# Altium schematic sheet SDRAM.SchDoc
size A4
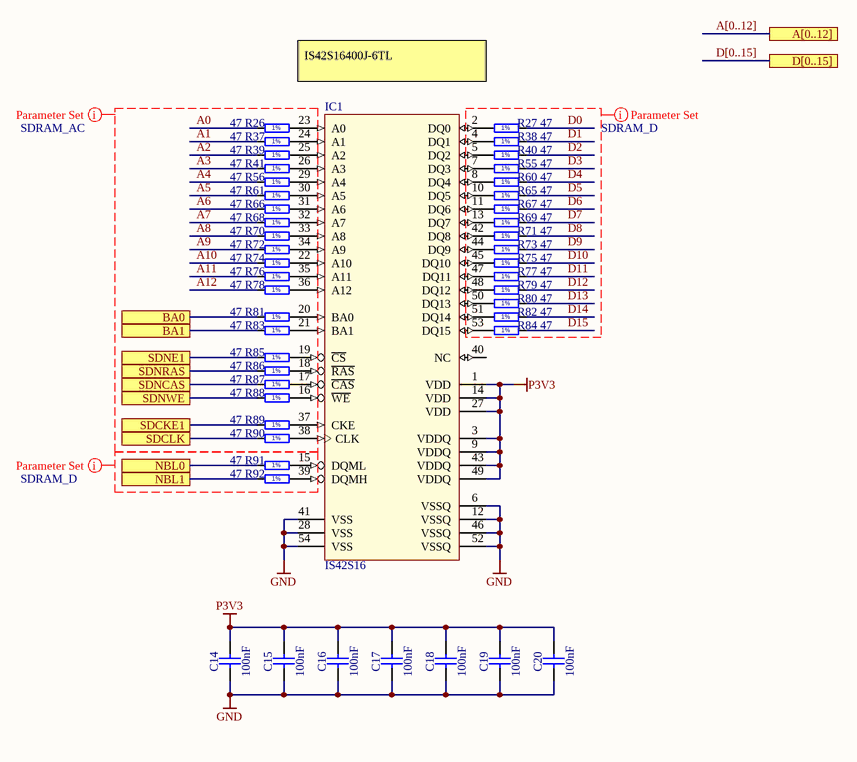
[diagram p0: SDRAM.SchDoc]

## Parts
C14  100nF  [CAPC1005X55N]
C15  100nF  [CAPC1005X55N]
C16  100nF  [CAPC1005X55N]
C17  100nF  [CAPC1005X55N]
C18  100nF  [CAPC1005X55N]
C19  100nF  [CAPC1005X55N]
C20  100nF  [CAPC1005X55N]
IC1  IS42S16  [TSOP-54]
R26  47  [RESC1005X40N]
R27  47  [RESC1005X40N]
R37  47  [RESC1005X40N]
R38  47  [RESC1005X40N]
R39  47  [RESC1005X40N]
R40  47  [RESC1005X40N]
R41  47  [RESC1005X40N]
R55  47  [RESC1005X40N]
R56  47  [RESC1005X40N]
R60  47  [RESC1005X40N]
R61  47  [RESC1005X40N]
R65  47  [RESC1005X40N]
R66  47  [RESC1005X40N]
R67  47  [RESC1005X40N]
R68  47  [RESC1005X40N]
R69  47  [RESC1005X40N]
R70  47  [RESC1005X40N]
R71  47  [RESC1005X40N]
R72  47  [RESC1005X40N]
R73  47  [RESC1005X40N]
R74  47  [RESC1005X40N]
R75  47  [RESC1005X40N]
R76  47  [RESC1005X40N]
R77  47  [RESC1005X40N]
R78  47  [RESC1005X40N]
R79  47  [RESC1005X40N]
R80  47  [RESC1005X40N]
R81  47  [RESC1005X40N]
R82  47  [RESC1005X40N]
R83  47  [RESC1005X40N]
R84  47  [RESC1005X40N]
R85  47  [RESC1005X40N]
R86  47  [RESC1005X40N]
R87  47  [RESC1005X40N]
R88  47  [RESC1005X40N]
R89  47  [RESC1005X40N]
R90  47  [RESC1005X40N]
R91  47  [RESC1005X40N]
R92  47  [RESC1005X40N]

## Ports
A[0..12], BA0, BA1, D[0..15], NBL0, NBL1, SDCKE1, SDCLK, SDNCAS, SDNE1, SDNRAS, SDNWE

## Nets
GND: C14.1 C15.1 C16.1 C17.1 C18.1 C19.1 C20.1 IC1.6(VSSQ) IC1.12(VSSQ) IC1.28(VSS) IC1.41(VSS) IC1.46(VSSQ) IC1.52(VSSQ) IC1.54(VSS)
P3V3: C14.2 C15.2 C16.2 C17.2 C18.2 C19.2 C20.2 IC1.1(VDD) IC1.3(VDDQ) IC1.9(VDDQ) IC1.14(VDD) IC1.27(VDD) IC1.43(VDDQ) IC1.49(VDDQ)
A0: R26.2
A1: R37.2
A2: R39.2
A3: R41.2
A4: R56.2
A5: R61.2
A6: R66.2
A7: R68.2
A8: R70.2
A9: R72.2
A10: R74.2
A11: R76.2
A12: R78.2
BA0: R81.2 ; port BA0
BA1: R83.2 ; port BA1
D0: R27.2
D1: R38.2
D2: R40.2
D3: R55.2
D4: R60.2
D5: R65.2
D6: R67.2
D7: R69.2
D8: R71.2
D9: R73.2
D10: R75.2
D11: R77.2
D12: R79.2
D13: R80.2
D14: R82.2
D15: R84.2
NBL0: R91.2 ; port NBL0
NBL1: R92.2 ; port NBL1
SDCKE1: R89.2 ; port SDCKE1
SDCLK: R90.2 ; port SDCLK
SDNCAS: R87.2 ; port SDNCAS
SDNE1: R85.2 ; port SDNE1
SDNRAS: R86.2 ; port SDNRAS
SDNWE: R88.2 ; port SDNWE
NetIC1_2: IC1.2(DQ0) R27.1
NetIC1_4: IC1.4(DQ1) R38.1
NetIC1_5: IC1.5(DQ2) R40.1
NetIC1_7: IC1.7(DQ3) R55.1
NetIC1_8: IC1.8(DQ4) R60.1
NetIC1_10: IC1.10(DQ5) R65.1
NetIC1_11: IC1.11(DQ6) R67.1
NetIC1_13: IC1.13(DQ7) R69.1
NetIC1_15: IC1.15(DQML) R91.1
NetIC1_16: IC1.16(~{WE}) R88.1
NetIC1_17: IC1.17(~{CAS}) R87.1
NetIC1_18: IC1.18(~{RAS}) R86.1
NetIC1_19: IC1.19(~{CS}) R85.1
NetIC1_20: IC1.20(BA0) R81.1
NetIC1_21: IC1.21(BA1) R83.1
NetIC1_22: IC1.22(A10) R74.1
NetIC1_23: IC1.23(A0) R26.1
NetIC1_24: IC1.24(A1) R37.1
NetIC1_25: IC1.25(A2) R39.1
NetIC1_26: IC1.26(A3) R41.1
NetIC1_29: IC1.29(A4) R56.1
NetIC1_30: IC1.30(A5) R61.1
NetIC1_31: IC1.31(A6) R66.1
NetIC1_32: IC1.32(A7) R68.1
NetIC1_33: IC1.33(A8) R70.1
NetIC1_34: IC1.34(A9) R72.1
NetIC1_35: IC1.35(A11) R76.1
NetIC1_36: IC1.36(A12) R78.1
NetIC1_37: IC1.37(CKE) R89.1
NetIC1_38: IC1.38(CLK) R90.1
NetIC1_39: IC1.39(DQMH) R92.1
NetIC1_42: IC1.42(DQ8) R71.1
NetIC1_44: IC1.44(DQ9) R73.1
NetIC1_45: IC1.45(DQ10) R75.1
NetIC1_47: IC1.47(DQ11) R77.1
NetIC1_48: IC1.48(DQ12) R79.1
NetIC1_50: IC1.50(DQ13) R80.1
NetIC1_51: IC1.51(DQ14) R82.1
NetIC1_53: IC1.53(DQ15) R84.1

Not connected (* = marked no-connect by the designer): IC1 40(NC)

## Buses and harness runs
bus A[0..12] = port A[0..12]
bus D[0..15] = port D[0..15]

## Layout directives
net class SDRAM_AC: A0, A1, A2, A3, A4, A5, A6, A7, A8, A9, A10, A11, A12
net class SDRAM_D: (no net found under the mark), D0, D1, D2, D3, D4, D5, D6, D7, D8, D9, D10, D11, D12, D13, D14, D15

## Notes on the sheet
- IS42S16400J-6TL
- (in symbol R0402_47R_1%_0.0625W_100PPM) 1%

## Library data of the parts
C14-C20 = CC0402_100NF_16V_10%_X5R: Non-polarised capacitor; Part Description: SMD Multilayer Chip Ceramic Capacitor; Manufacturer: GENERIC; Manufacturer1 Part Number: GRM155R61C104KA88D; Voltage: 16V; TC: X5R; Tolerance: ±10%; Part Number: CC0402_100NF_16V_10%_X5R; Component Kind: Standard; Component Type: Standard; Pin Count: 2; Value: 100nF; Status: None; Manufacturer Part Number: CC0402_100NF_16V_10%_X5R; Case: 0402; Mounted: Yes; Socket: No; SMD: Yes; Sense: No; Manufacturer1 Example: MURATA; Manufacturer1 ComponentHeight: 0.55mm; HelpURL: \\cern.ch\dfs\Applications\Altium\Datasheets\CC0402_X5R_MURATA_GRM.pdf; Author: CERN DEM JLC; CreateDate: 2013-12-10; LatestRevisionDate: 2013-12-10
IC1 = IS42S16: SDRAM 64m 200mhz 54tsop; MP: IS42S16400J-5TL-TR; MF: ISSI; Availability: Unavailable; Package: TSOP-54 ISSI; Price: 1.24 USD; Value: *
R26 R27 R37-R41 R55 R56 R60 R61 R65-R92 = R0402_47R_1%_0.0625W_100PPM: Resistor - 1%; Part Description: General Purpose Thick Film Chip Resistor; Manufacturer: GENERIC; Manufacturer1 Part Number: 232270674709L; TC: ±100ppm/°C; Part Number: R0402_47R_1%_0.0625W_100PPM; Component Kind: Standard; Component Type: Standard; Pin Count: 2; Value: 47; Status: Not recommended; Power: 0.0625W; Tolerance: ±1%; Manufacturer Part Number: R0402_47R_1%_0.0625W_100PPM; Case: 0402; Mounted: Yes; Sense: No; Socket: No; SMD: Yes; Manufacturer1 Example: YAGEO PHYCOMP; Manufacturer1 ComponentHeight: 0.4mm; HelpURL: \\cern.ch\dfs\Applications\Altium\Datasheets\R0402_Phycomp_RC0402.pdf; Author: CERN DEM JLC; CreateDate: 2007-12-03; LatestRevisionDate: 2012-10-17